# EAGLE design traffic_lights (EAGLE 7.2.0)
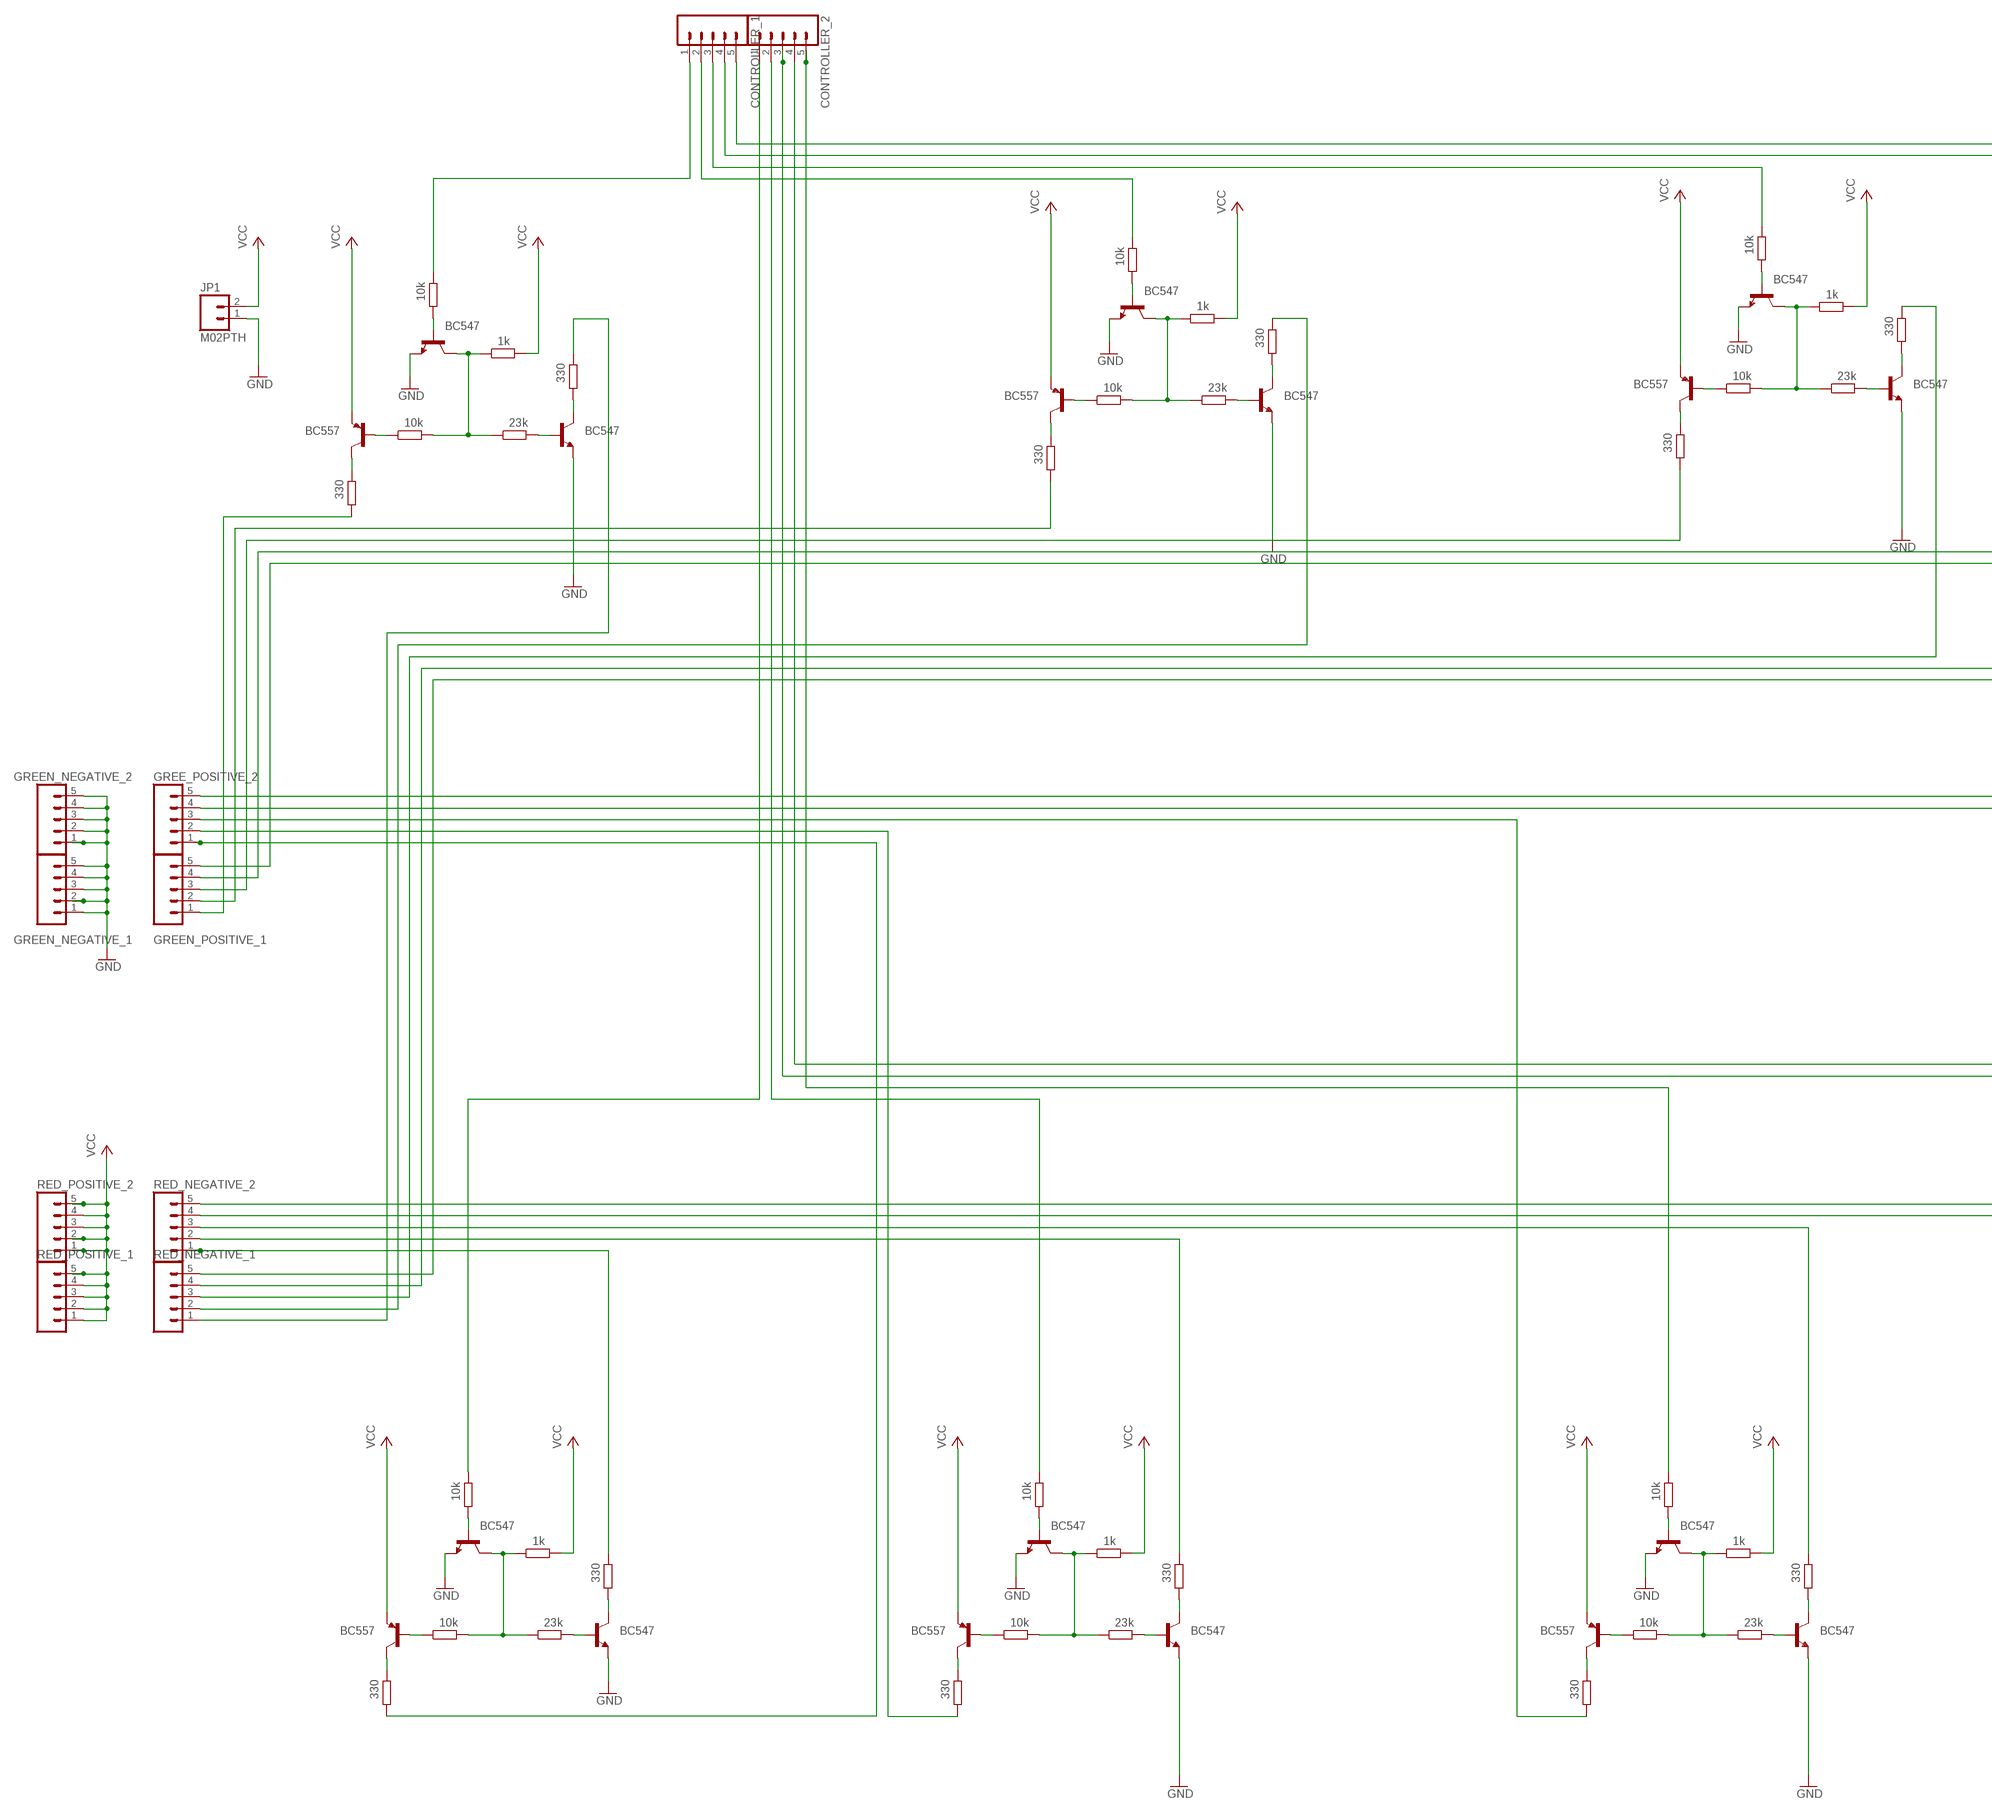
[diagram p0: schematic, sheet 1, part 1 of 2]
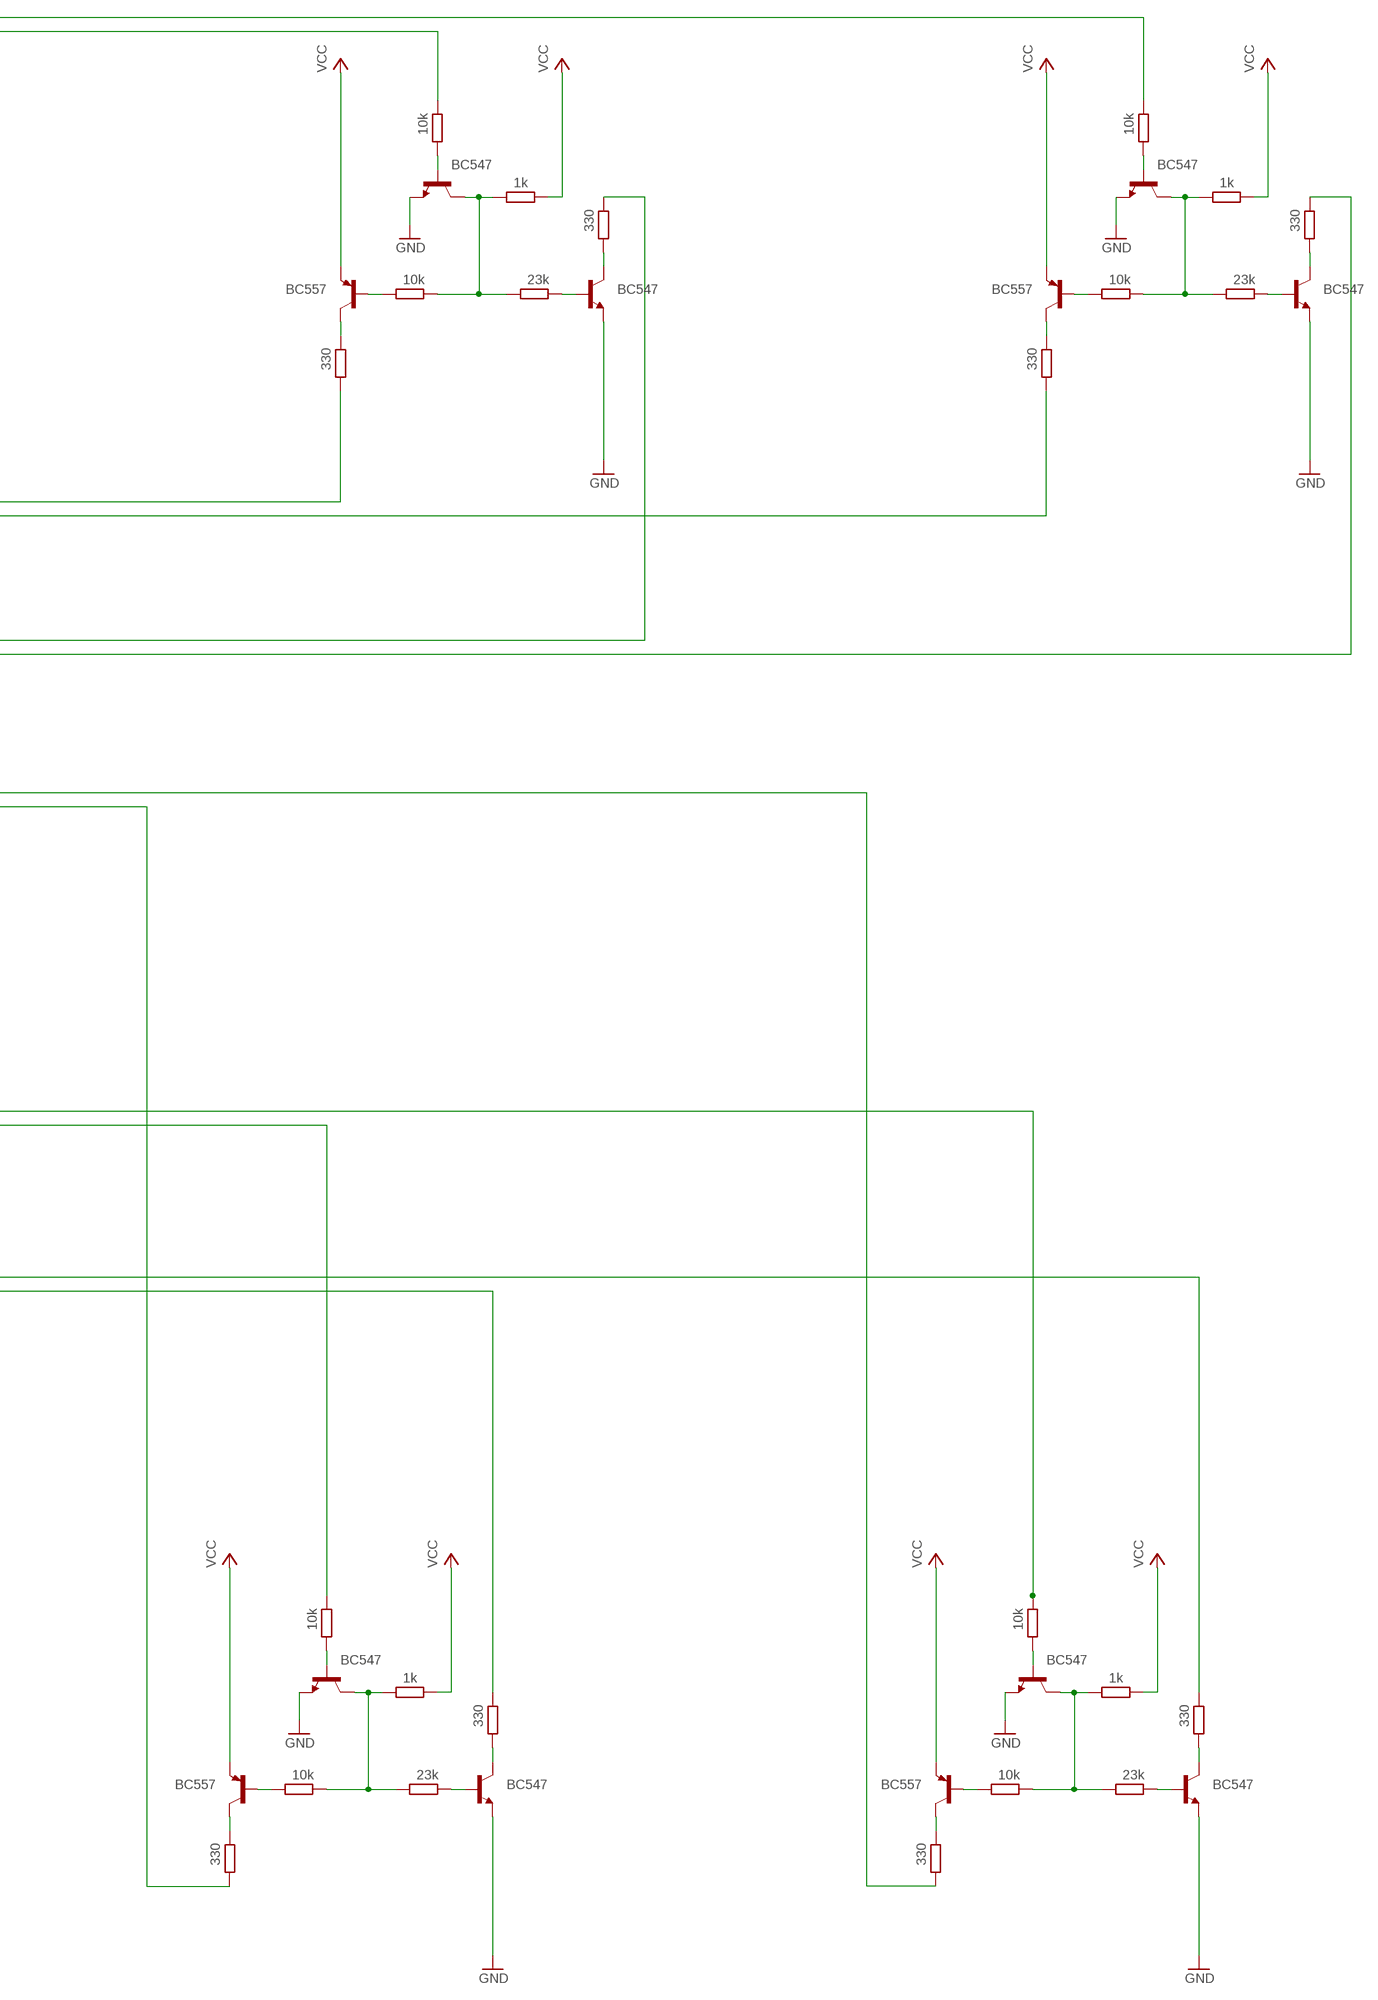
[diagram p1: schematic, sheet 1, part 2 of 2]

## Parts
CONTROLLER_1  M05PTH  [1X05]
CONTROLLER_2  M05PTH  [1X05]
GREE_POSITIVE_2  M05PTH  [1X05]
GREEN_NEGATIVE_1  M05PTH  [1X05]
GREEN_NEGATIVE_2  M05PTH  [1X05]
GREEN_POSITIVE_1  M05PTH  [1X05]
JP1  M02PTH  [1X02]
RC1  10k  R-EU_0207/10  [0207/10]
RC2  1k  R-EU_0207/10  [0207/10]
RC3  23k  R-EU_0207/10  [0207/10]
RC4  10k  R-EU_0207/10  [0207/10]
RC5  330  R-EU_0207/10  [0207/10]
RC6  330  R-EU_0207/10  [0207/10]
RC21  10k  R-EU_0207/10  [0207/10]
RC22  1k  R-EU_0207/10  [0207/10]
RC23  23k  R-EU_0207/10  [0207/10]
RC24  10k  R-EU_0207/10  [0207/10]
RC25  330  R-EU_0207/10  [0207/10]
RC26  330  R-EU_0207/10  [0207/10]
RC31  10k  R-EU_0207/10  [0207/10]
RC32  1k  R-EU_0207/10  [0207/10]
RC33  23k  R-EU_0207/10  [0207/10]
RC34  10k  R-EU_0207/10  [0207/10]
RC35  330  R-EU_0207/10  [0207/10]
RC36  330  R-EU_0207/10  [0207/10]
RC41  10k  R-EU_0207/10  [0207/10]
RC42  1k  R-EU_0207/10  [0207/10]
RC43  23k  R-EU_0207/10  [0207/10]
RC44  10k  R-EU_0207/10  [0207/10]
RC45  330  R-EU_0207/10  [0207/10]
RC46  330  R-EU_0207/10  [0207/10]
RC51  10k  R-EU_0207/10  [0207/10]
RC52  1k  R-EU_0207/10  [0207/10]
RC53  23k  R-EU_0207/10  [0207/10]
RC54  10k  R-EU_0207/10  [0207/10]
RC55  330  R-EU_0207/10  [0207/10]
RC56  330  R-EU_0207/10  [0207/10]
RC61  10k  R-EU_0207/10  [0207/10]
RC62  1k  R-EU_0207/10  [0207/10]
RC63  23k  R-EU_0207/10  [0207/10]
RC64  10k  R-EU_0207/10  [0207/10]
RC65  330  R-EU_0207/10  [0207/10]
RC66  330  R-EU_0207/10  [0207/10]
RC71  10k  R-EU_0207/10  [0207/10]
RC72  1k  R-EU_0207/10  [0207/10]
RC73  23k  R-EU_0207/10  [0207/10]
RC74  10k  R-EU_0207/10  [0207/10]
RC75  330  R-EU_0207/10  [0207/10]
RC76  330  R-EU_0207/10  [0207/10]
RC81  10k  R-EU_0207/10  [0207/10]
RC82  1k  R-EU_0207/10  [0207/10]
RC83  23k  R-EU_0207/10  [0207/10]
RC84  10k  R-EU_0207/10  [0207/10]
RC85  330  R-EU_0207/10  [0207/10]
RC86  330  R-EU_0207/10  [0207/10]
RC91  10k  R-EU_0207/10  [0207/10]
RC92  1k  R-EU_0207/10  [0207/10]
RC93  23k  R-EU_0207/10  [0207/10]
RC94  10k  R-EU_0207/10  [0207/10]
RC95  330  R-EU_0207/10  [0207/10]
RC96  330  R-EU_0207/10  [0207/10]
RC101  10k  R-EU_0207/10  [0207/10]
RC102  1k  R-EU_0207/10  [0207/10]
RC103  23k  R-EU_0207/10  [0207/10]
RC104  10k  R-EU_0207/10  [0207/10]
RC105  330  R-EU_0207/10  [0207/10]
RC106  330  R-EU_0207/10  [0207/10]
RED_NEGATIVE_1  M05PTH  [1X05]
RED_NEGATIVE_2  M05PTH  [1X05]
RED_POSITIVE_1  M05PTH  [1X05]
RED_POSITIVE_2  M05PTH  [1X05]
TCTRL1  BC547  [TO92]
TCTRL2  BC547  [TO92]
TCTRL3  BC547  [TO92]
TCTRL4  BC547  [TO92]
TCTRL5  BC547  [TO92]
TCTRL6  BC547  [TO92]
TCTRL7  BC547  [TO92]
TCTRL8  BC547  [TO92]
TCTRL9  BC547  [TO92]
TCTRL10  BC547  [TO92]
TGR1  BC547  [TO92]
TGR2  BC547  [TO92]
TGR3  BC547  [TO92]
TGR4  BC547  [TO92]
TGR5  BC547  [TO92]
TGR6  BC547  [TO92]
TGR7  BC547  [TO92]
TGR8  BC547  [TO92]
TGR9  BC547  [TO92]
TGR10  BC547  [TO92]
TR1  BC557  [TO92]
TR2  BC557  [TO92]
TR3  BC557  [TO92]
TR4  BC557  [TO92]
TR5  BC557  [TO92]
TR6  BC557  [TO92]
TR7  BC557  [TO92]
TR8  BC557  [TO92]
TR9  BC557  [TO92]
TR10  BC557  [TO92]

## Nets
GND: GREEN_NEGATIVE_1.1 GREEN_NEGATIVE_1.2 GREEN_NEGATIVE_1.3 GREEN_NEGATIVE_1.4 GREEN_NEGATIVE_1.5 GREEN_NEGATIVE_2.1 GREEN_NEGATIVE_2.2 GREEN_NEGATIVE_2.3 GREEN_NEGATIVE_2.4 GREEN_NEGATIVE_2.5 JP1.1 TCTRL1.1(E) TCTRL2.1(E) TCTRL3.1(E) TCTRL4.1(E) TCTRL5.1(E) TCTRL6.1(E) TCTRL7.1(E) TCTRL8.1(E) TCTRL9.1(E) TCTRL10.1(E) TGR1.1(E) TGR2.1(E) TGR3.1(E) TGR4.1(E) TGR5.1(E) TGR6.1(E) TGR7.1(E) TGR8.1(E) TGR9.1(E) TGR10.1(E)
N$1: GREEN_POSITIVE_1.1 RC6.1
N$2: RC21.1 TCTRL2.2(B)
N$3: RC24.1 TR2.2(B)
N$4: RC2.1 RC3.1 RC4.2 TCTRL1.3(C)
N$5: RC1.1 TCTRL1.2(B)
N$6: RC4.1 TR1.2(B)
N$7: RC6.2 TR1.3(C)
N$8: RC26.2 TR2.3(C)
N$9: RC35.2 RED_NEGATIVE_1.3
N$10: RC5.1 TGR1.3(C)
N$11: RC3.2 TGR1.2(B)
N$12: CONTROLLER_1.1 RC1.2
N$13: RC25.2 RED_NEGATIVE_1.2
N$14: RC25.1 TGR2.3(C)
N$15: RC23.2 TGR2.2(B)
N$16: CONTROLLER_1.2 RC21.2
N$17: RC22.1 RC23.1 RC24.2 TCTRL2.3(C)
N$18: CONTROLLER_1.3 RC31.2
N$19: RC31.1 TCTRL3.2(B)
N$20: RC34.1 TR3.2(B)
N$21: RC36.2 TR3.3(C)
N$22: RC45.2 RED_NEGATIVE_1.4
N$23: RC35.1 TGR3.3(C)
N$24: RC33.2 TGR3.2(B)
N$25: CONTROLLER_1.4 RC41.2
N$26: RC32.1 RC33.1 RC34.2 TCTRL3.3(C)
N$27: GREEN_POSITIVE_1.2 RC26.1
N$28: RC41.1 TCTRL4.2(B)
N$29: RC44.1 TR4.2(B)
N$30: RC46.2 TR4.3(C)
N$31: RC55.2 RED_NEGATIVE_1.5
N$32: RC45.1 TGR4.3(C)
N$33: RC43.2 TGR4.2(B)
N$34: CONTROLLER_1.5 RC51.2
N$35: RC42.1 RC43.1 RC44.2 TCTRL4.3(C)
N$36: GREEN_POSITIVE_1.4 RC46.1
N$37: RC51.1 TCTRL5.2(B)
N$38: RC54.1 TR5.2(B)
N$39: RC56.2 TR5.3(C)
N$40: GREEN_POSITIVE_1.3 RC36.1
N$41: RC55.1 TGR5.3(C)
N$42: RC53.2 TGR5.2(B)
N$43: RC5.2 RED_NEGATIVE_1.1
N$44: RC52.1 RC53.1 RC54.2 TCTRL5.3(C)
N$45: GREEN_POSITIVE_1.5 RC56.1
N$46: RC71.1 TCTRL7.2(B)
N$47: RC74.1 TR7.2(B)
N$48: RC76.2 TR7.3(C)
N$49: RC75.2 RED_NEGATIVE_2.2
N$50: RC75.1 TGR7.3(C)
N$51: RC73.2 TGR7.2(B)
N$52: CONTROLLER_2.1 RC61.2
N$53: RC72.1 RC73.1 RC74.2 TCTRL7.3(C)
N$54: RC85.2 RED_NEGATIVE_2.3
N$55: RC81.1 TCTRL8.2(B)
N$56: RC84.1 TR8.2(B)
N$57: RC86.2 TR8.3(C)
N$58: RC95.2 RED_NEGATIVE_2.4
N$59: RC85.1 TGR8.3(C)
N$60: RC83.2 TGR8.2(B)
N$61: CONTROLLER_2.2 RC71.2
N$62: RC82.1 RC83.1 RC84.2 TCTRL8.3(C)
N$63: RC105.2 RED_NEGATIVE_2.5
N$64: RC91.1 TCTRL9.2(B)
N$65: RC94.1 TR9.2(B)
N$66: RC96.2 TR9.3(C)
N$67: GREE_POSITIVE_2.1 RC66.1
N$68: RC95.1 TGR9.3(C)
N$69: RC93.2 TGR9.2(B)
N$70: CONTROLLER_2.5 RC81.2
N$71: RC92.1 RC93.1 RC94.2 TCTRL9.3(C)
N$72: GREE_POSITIVE_2.2 RC76.1
N$73: RC101.1 TCTRL10.2(B)
N$74: RC104.1 TR10.2(B)
N$75: RC106.2 TR10.3(C)
N$76: GREE_POSITIVE_2.3 RC86.1
N$77: RC105.1 TGR10.3(C)
N$78: RC103.2 TGR10.2(B)
N$79: CONTROLLER_2.3 RC91.2
N$80: RC102.1 RC103.1 RC104.2 TCTRL10.3(C)
N$81: GREE_POSITIVE_2.4 RC96.1
N$82: RC61.1 TCTRL6.2(B)
N$83: RC64.1 TR6.2(B)
N$84: RC66.2 TR6.3(C)
N$85: RC65.2 RED_NEGATIVE_2.1
N$86: RC65.1 TGR6.3(C)
N$87: RC63.2 TGR6.2(B)
N$88: GREE_POSITIVE_2.5 RC106.1
N$89: RC62.1 RC63.1 RC64.2 TCTRL6.3(C)
N$90: CONTROLLER_2.4 RC101.2
VCC: JP1.2 RC2.2 RC22.2 RC32.2 RC42.2 RC52.2 RC62.2 RC72.2 RC82.2 RC92.2 RC102.2 RED_POSITIVE_1.1 RED_POSITIVE_1.2 RED_POSITIVE_1.3 RED_POSITIVE_1.4 RED_POSITIVE_1.5 RED_POSITIVE_2.1 RED_POSITIVE_2.2 RED_POSITIVE_2.3 RED_POSITIVE_2.4 RED_POSITIVE_2.5 TR1.1(E) TR2.1(E) TR3.1(E) TR4.1(E) TR5.1(E) TR6.1(E) TR7.1(E) TR8.1(E) TR9.1(E) TR10.1(E)

## Library data of the parts
CONTROLLER_1 CONTROLLER_2 GREE_POSITIVE_2 GREEN_NEGATIVE_1 GREEN_NEGATIVE_2 GREEN_POSITIVE_1 RED_NEGATIVE_1 RED_NEGATIVE_2 RED_POSITIVE_1 RED_POSITIVE_2 = SparkFun-Connectors:M05: Header 5 Standard 5-pin 0.1" header. Use with straight break away headers (SKU : PRT-00116), right angle break away headers (PRT-00553), swiss pins (PRT-00743), machine pins (PRT-00117), and female headers (PRT-00115). Molex polarized connector foot print use with SKU : PRT-08230 with associated crimp pins and housings.
JP1 = SparkFun-Connectors:M02: Standard 2-pin 0.1" header. Use with - straight break away headers ( PRT-00116) - right angle break away headers (PRT-00553) - swiss pins (PRT-00743) - machine pins (PRT-00117) - female headers (PRT-00115) Molex polarized connector foot print use with: PRT-08233 with associated crimp pins and housings. 2.54_SCREWTERM for use with PRT-10571. 3.5mm Screw Terminal footprints for PRT-08084 5mm Screw Terminal footprints for use with PRT-08432
RC1-RC6 RC21-RC26 RC31-RC36 RC41-RC46 RC51-RC56 RC61-RC66 RC71-RC76 RC81-RC86 RC91-RC96 RC101-RC106 = resistor:R-EU_: RESISTOR, European symbol
TCTRL1-TCTRL10 TGR1-TGR10 = transistor:BC547: NPN TRANSISTOR
TR1-TR10 = transistor-pnp:BC557: PNP Transistor

## Net classes
0 default: width 0.762 mm

## Board
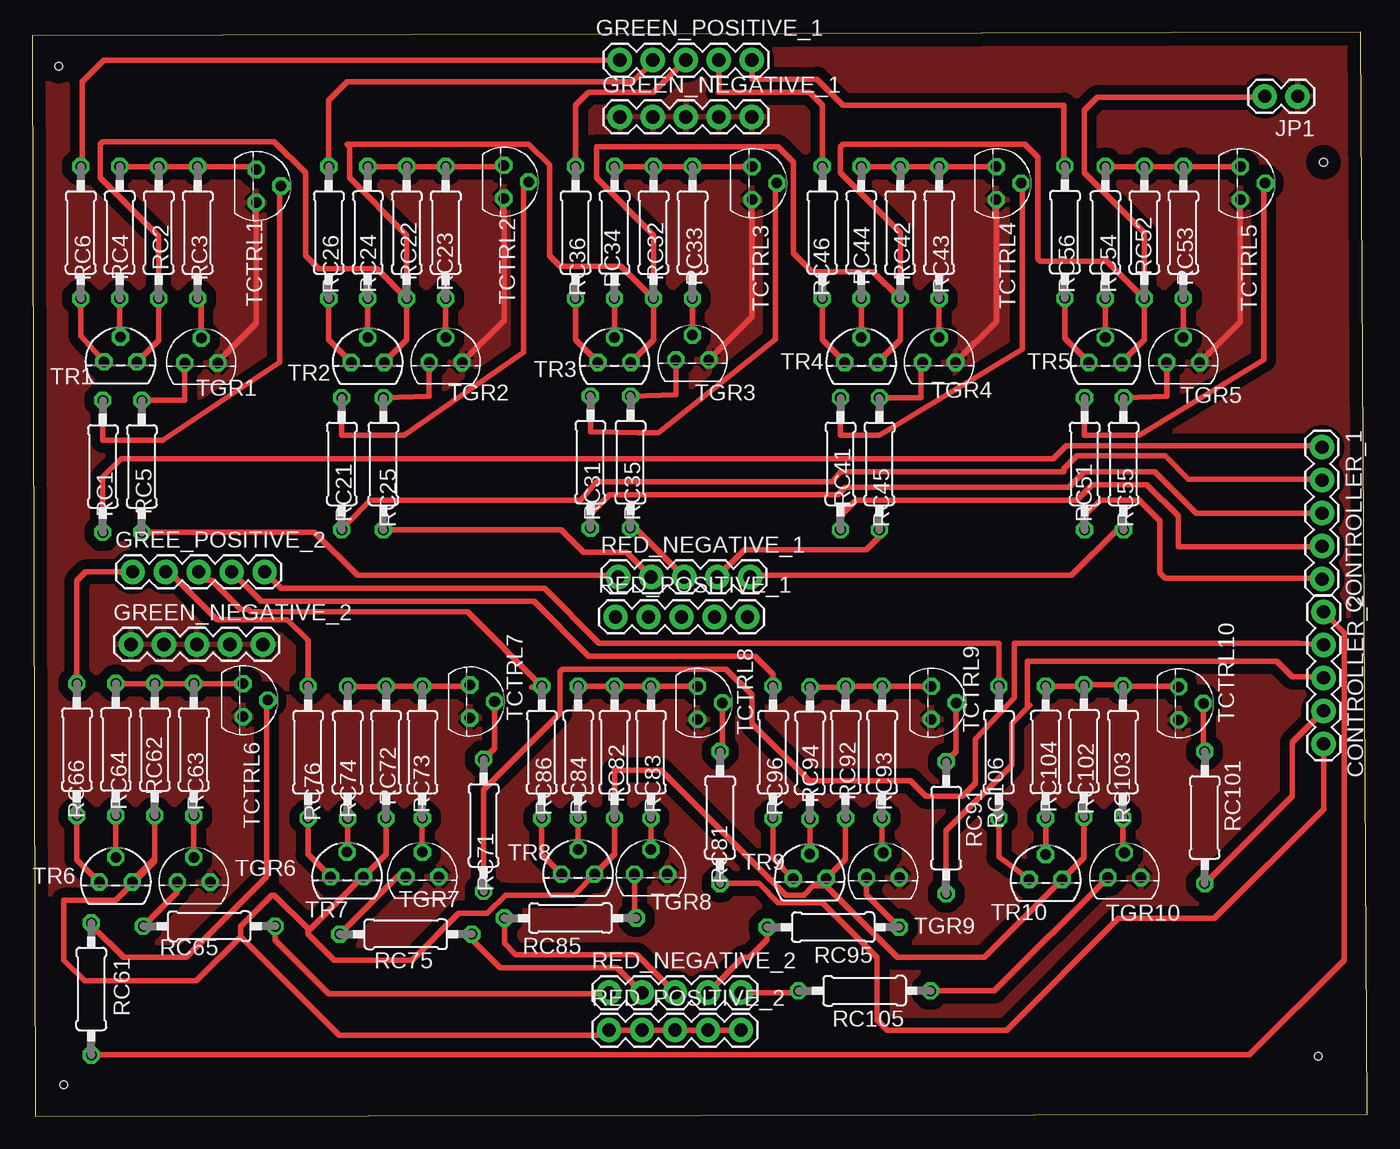
[diagram p2: board, top side]
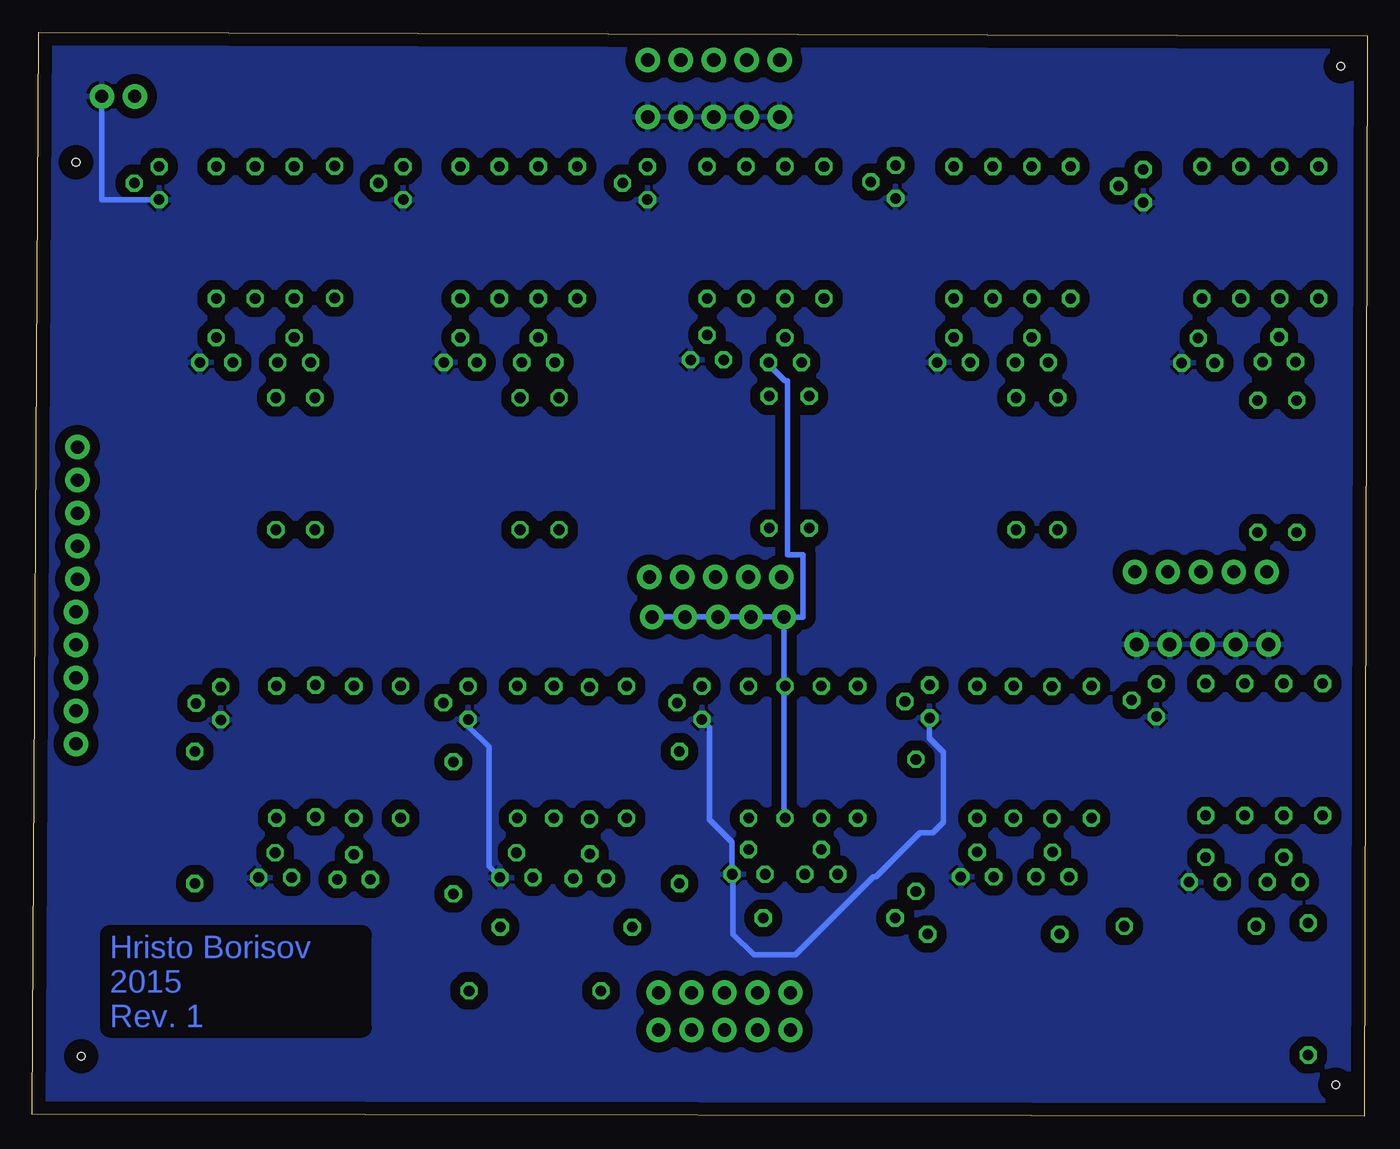
[diagram p3: board, bottom side, seen from below]

Size 102.77 x 83.41 mm. Coordinates in mm from the lower left corner, seen from the top.
Outline: 0.23,0 102.77,0.12 102.27,83.41 0,83.14 0.23,0
Copper layers (1*16): Top 0.035mm / dielectric 1.5mm / Bottom 0.035mm
Design rules "default *": minimum track width 10mil, minimum drill 24mil, track to track 30mil, track to pad 30mil, pad to pad 30mil, via to via 30mil, smd to smd 8mil, copper to edge 40mil, drill to drill 8mil, minimum pad ring 10mil, minimum via ring 8mil, stop-mask expansion 4mil, vias tented up to drill 0mil, thermal gap 10mil
Holes 0.6 mm at 99.42,73.41 2.02,80.81 2.42,2.41 99.02,4.61

### Footprints (pad centres in the part's own frame; a part is rotated, then mirrored left to right if it is on the bottom)
1X05 = drill 1.016 pad 1.88: 1 0,0; 2 2.54,0; 3 5.08,0; 4 7.62,0; 5 10.16,0
1X02 = drill 1.016 pad 1.88: 1 0,0; 2 2.54,0
0207/10 = drill 0.813 octagon: 1 -5.08,0; 2 5.08,0
TO92 = drill 0.813 octagon: 1 1.27,0; 2 0,1.905; 3 -1.27,0

### Placement (x,y rotation side)
CONTROLLER_1  99.3,51.49 270 top
CONTROLLER_2  99.42,38.81 270 top
GREE_POSITIVE_2  7.72,41.89 0 top
GREEN_NEGATIVE_1  45.23,76.91 0 top
GREEN_NEGATIVE_2  7.58,36.3 0 top
GREEN_POSITIVE_1  45.23,81.29 0 top
JP1  97.43,78.49 180 top
RC1  5.42,50.01 270 top
RC2  9.72,68.01 270 top
RC3  12.72,68.01 270 top
RC4  6.72,68.01 90 top
RC5  8.42,50.01 270 top
RC6  3.72,68.01 270 top
RC21  23.82,50.21 270 top
RC22  28.82,68.01 270 top
RC23  31.82,68.01 270 top
RC24  25.82,68.01 90 top
RC25  27.02,50.21 270 top
RC26  22.82,68.01 270 top
RC31  42.96,50.33 270 top
RC32  47.82,68.01 270 top
RC33  50.82,68.01 270 top
RC34  44.82,68.01 90 top
RC35  46.05,50.33 270 top
RC36  41.82,68.01 270 top
RC41  62.22,50.21 270 top
RC42  66.82,68.01 270 top
RC43  69.82,68.01 270 top
RC44  63.82,68.01 90 top
RC45  65.22,50.21 270 top
RC46  60.82,68.01 270 top
RC51  81.02,50.21 270 top
RC52  85.62,68.01 270 top
RC53  88.62,68.01 270 top
RC54  82.62,68.01 90 top
RC55  84.02,50.21 270 top
RC56  79.5,68.04 270 top
RC61  4.53,9.78 270 top
RC62  9.42,28.21 270 top
RC63  12.42,28.21 270 top
RC64  6.42,28.21 90 top
RC65  13.62,14.61 0 top
RC66  3.42,28.21 270 top
RC71  34.74,22.38 270 top
RC72  27.22,28.01 270 top
RC73  30.02,28.01 270 top
RC74  24.27,27.98 90 top
RC75  28.75,14 0 top
RC76  21.22,28.01 270 top
RC81  52.95,22.98 270 top
RC82  44.82,28.01 270 top
RC83  47.62,28.01 270 top
RC84  42.02,28.01 90 top
RC85  41.42,15.24 180 top
RC86  39.22,28.01 270 top
RC91  70.36,22.18 270 top
RC92  62.62,28.01 270 top
RC93  65.42,28.01 270 top
RC94  59.87,27.94 90 top
RC95  61.66,14.54 180 top
RC96  57.02,28.01 270 top
RC101  90.27,22.98 270 top
RC102  80.97,28.1 270 top
RC103  83.97,28.02 270 top
RC104  78.02,28.01 90 top
RC105  64.07,9.64 180 top
RC106  74.42,28.01 270 top
RED_NEGATIVE_1  45.1,41.5 0 top
RED_NEGATIVE_2  44.4,9.5 0 top
RED_POSITIVE_1  44.9,38.42 0 top
RED_POSITIVE_2  44.4,6.62 0 top
TCTRL1  17.23,71.59 270 top
TCTRL2  36.3,71.91 270 top
TCTRL3  55.42,71.81 270 top
TCTRL4  74.22,71.81 270 top
TCTRL5  93.02,71.81 270 top
TCTRL6  16.22,32.01 270 top
TCTRL7  33.68,31.91 270 top
TCTRL8  51.22,31.81 270 top
TCTRL9  69.22,31.81 270 top
TCTRL10  88.27,31.77 270 top
TGR1  13,57.97 0 top
TGR2  31.82,58.01 0 top
TGR3  50.82,58.21 0 top
TGR4  69.82,58.01 0 top
TGR5  88.62,58.01 0 top
TGR6  12.42,18.01 0 top
TGR7  30.02,18.41 0 top
TGR8  47.62,18.61 0 top
TGR9  65.5,18.36 0 top
TGR10  84.08,18.36 0 top
TR1  6.78,58.06 0 top
TR2  25.82,58.01 0 top
TR3  44.82,58.01 0 top
TR4  63.82,58.01 0 top
TR5  82.62,58.01 0 top
TR6  6.42,18.01 0 top
TR7  24.22,18.41 0 top
TR8  42.02,18.61 0 top
TR9  59.85,18.28 0 top
TR10  78.02,18.21 0 top

### Tracks (layer width: path | path; a pad name or v marks a point on that pad's centre or on a via)
GND
  Top 0.406: TGR1.1 14.27,58.06 17.22,61.01 TCTRL1.1 | TCTRL2.1 36.3,61.22 TGR2.1 | TCTRL3.1 55.42,61.54 TGR3.1 | TCTRL4.1 74.22,61.14 TGR4.1 | TCTRL5.1 93.02,61.14 TGR5.1
  Bottom 0.406: 55.39,70.57 TCTRL3.1 | TCTRL7.1 33.68,29.07 32.62,28.01 32.62,22.61 33.42,21.81 34.42,21.81 37.82,18.41 38.02,18.41 44.02,12.41 47.22,12.41 48.82,14.01 48.82,18.54 TGR8.1 48.89,21.08 50.62,22.81 50.62,29.94 TCTRL8.1 | TCTRL9.1 69.22,30.01 67.62,28.41 67.62,19.21 TGR9.1 | 14.27,58.01 TGR1.1 | TCTRL5.1 97.43,70.54 JP1.1
  pour Top: -2.58,88.46 105.14,88.46 104.64,-3.69 -2.58,-4.19
  pour Bottom: -3.38,85.61 106.02,85.61 106.02,-5.59 -3.58,-5.59 -3.58,86.21 -3.38,86.21
N$1
  Top 0.406: GREEN_POSITIVE_1.1 5.5,81.29 3.82,79.61 3.82,73.19 RC6.1
N$2
  Top 0.406: RC21.1 23.82,52.41 28.62,52.41 37.82,58.81 37.82,71.53 TCTRL2.2
N$3
  Top 0.406: RC24.1 TR2.2
N$4
  Top 0.406: RC4.2 RC2.1 RC3.1 17,73.09 TCTRL1.3
N$5
  Top 0.406: RC1.1 5.42,52.01 10.02,52.01 19.02,58.01 19.02,71.48 TCTRL1.2
N$6
  Top 0.406: RC4.1 6.72,60.02 TR1.2
N$7
  Top 0.406: RC6.2 3.72,60.05 TR1.3
N$8
  Top 0.406: RC26.2 22.82,59.74 TR2.3
N$9
  Top 0.406: RC35.2 46.43,45.25 RED_NEGATIVE_1.3
N$10
  Top 0.406: TGR1.3 11.73,55.09 RC5.1
N$11
  Top 0.406: TGR1.2 13,62.65 RC3.2
N$12
  Top 0.406: RC1.2 5.42,49.21 6.82,50.61 78.62,50.61 79.62,51.61 99.18,51.61 CONTROLLER_1.1
N$13
  Top 0.406: RC25.2 40.7,45.13 42.42,43.41 45.73,43.41 RED_NEGATIVE_1.2
N$14
  Top 0.406: TGR2.3 30.55,55.42 RC25.1
N$15
  Top 0.406: RC23.2 TGR2.2
N$16
  Top 0.406: RC21.2 24.22,45.61 26.02,47.41 42.22,47.41 43.42,48.81 61.62,48.81 62.22,49.61 79.42,49.61 79.42,49.81 80.42,50.81 87.22,50.81 89.02,49.01 99.24,49.01 CONTROLLER_1.2
N$17
  Top 0.406: RC24.2 RC22.1 RC23.1 36.21,73.09 TCTRL2.3
N$18
  Top 0.406: RC31.2 42.96,46.35 44.42,47.81 62.02,47.81 62.62,48.41 79.82,48.41 81.02,49.61 86.42,49.61 89.62,46.41 CONTROLLER_1.3
N$19
  Top 0.406: RC31.1 42.96,52.67 46.62,52.61 48.22,52.61 57.22,59.81 57.22,71.7 TCTRL3.2
N$20
  Top 0.406: RC34.1 TR3.2
N$21
  Top 0.406: RC36.2 41.82,59.74 TR3.3
N$22
  Top 0.406: RC45.2 65.22,44.61 64.22,43.61 54.83,43.61 RED_NEGATIVE_1.4
N$23
  Top 0.406: TGR3.3 49.55,55.51 RC35.1
N$24
  Top 0.406: TGR3.2 RC33.2
N$25
  Top 0.406: RC41.2 62.22,46.21 63.42,47.41 80.42,47.41 81.62,48.61 85.82,48.61 88.22,46.21 88.22,43.81 99.24,43.81 CONTROLLER_1.4
N$26
  Top 0.406: RC34.2 RC32.1 RC33.1 TCTRL3.3
N$27
  Top 0.406: GREEN_POSITIVE_1.2 47.77,81.16 46.22,79.61 24.22,79.61 22.82,78.21 RC26.1
N$28
  Top 0.406: RC41.1 62.22,52.41 65.22,52.41 76.22,59.01 76.22,71.72 TCTRL4.2
N$29
  Top 0.406: RC44.1 TR4.2
N$30
  Top 0.406: RC46.2 60.82,59.74 TR4.3
N$31
  Top 0.406: RC55.2 83.54,45.13 80.02,41.61 55.37,41.61 RED_NEGATIVE_1.5
N$32
  Top 0.406: TGR4.3 68.55,57.94 68.42,57.81 68.42,55.29 RC45.1
N$33
  Top 0.406: RC43.2 TGR4.2
N$34
  Top 0.406: RC51.2 81.02,46.21 82.22,47.41 85.22,47.41 86.82,45.81 86.82,41.81 87.22,41.41 99.22,41.41 CONTROLLER_1.5
N$35
  Top 0.406: RC44.2 RC42.1 RC43.1 TCTRL4.3
N$36
  Top 0.406: GREEN_POSITIVE_1.4 52.85,78.84 52.82,78.81 59.82,78.81 60.82,77.81 RC46.1
N$37
  Top 0.406: RC51.1 81.02,52.41 85.22,52.41 94.82,58.21 94.82,71.7 TCTRL5.2
N$38
  Top 0.406: RC54.1 TR5.2
N$39
  Top 0.406: RC56.2 79.5,59.86 TR5.3
N$40
  Top 0.406: GREEN_POSITIVE_1.3 47.82,78.81 42.82,78.81 41.82,77.81 RC36.1
N$41
  Top 0.406: TGR5.3 87.35,55.42 RC55.1
N$42
  Top 0.406: RC53.2 TGR5.2
N$43
  Top 0.406: RC5.2 21.7,44.93 25.02,41.61 44.99,41.61 RED_NEGATIVE_1.1
N$44
  Top 0.406: RC54.2 RC52.1 RC53.1 TCTRL5.3
N$45
  Top 0.406: GREEN_POSITIVE_1.5 55.39,79.84 55.42,79.81 60.42,79.81 62.42,77.81 79.42,77.81 79.42,73.2 RC56.1
N$46
  Top 0.406: TCTRL7.2 35.59,28.31 RC71.1
N$47
  Top 0.406: RC74.1 24.27,20.37 TR7.2
N$48
  Top 0.406: RC76.2 21.22,20.14 TR7.3
N$49
  Top 0.406: RC75.2 33.83,13.6 36.02,11.41 45.03,11.41 RED_NEGATIVE_2.2
N$50
  Top 0.406: TGR7.3 28.08,18.41 RC75.1
N$51
  Top 0.406: RC73.2 TGR7.2
N$52
  Top 0.406: RC61.2 93.71,4.7 101.02,12.01 101.02,37.21 CONTROLLER_2.1
N$53
  Top 0.406: RC74.2 27.19,33.06 RC72.1 RC73.1 33.59,33.09 TCTRL7.3
N$54
  Top 0.406: RC85.2 36.34,13.29 37.22,12.41 46.57,12.41 RED_NEGATIVE_2.3
N$55
  Top 0.406: TCTRL8.2 53.12,28.24 RC81.1
N$56
  Top 0.406: RC84.1 TR8.2
N$57
  Top 0.406: RC86.2 39.22,20.14 TR8.3
N$58
  Top 0.406: RC95.2 56.58,13.57 55.22,12.21 54.73,12.21 RED_NEGATIVE_2.4
N$59
  Top 0.406: TGR8.3 46.35,15.39 RC85.1
N$60
  Top 0.406: RC83.2 TGR8.2
N$61
  Top 0.406: RC71.2 34.74,25.13 40.62,31.01 40.62,34.21 40.82,34.41 53.42,34.41 55.42,32.41 55.42,30.21 59.82,25.81 67.62,25.81 68.82,24.61 71.62,24.61 72.62,25.61 72.62,29.01 75.62,32.21 75.62,36.41 97.56,36.41 CONTROLLER_2.2
N$62
  Top 0.406: RC84.2 RC82.1 RC83.1 TCTRL8.3
N$63
  Top 0.406: RED_NEGATIVE_2.5 58.85,9.5 RC105.2
N$64
  Top 0.406: TCTRL9.2 71.12,28.03 RC91.1
N$65
  Top 0.406: RC94.1 59.87,20.21 TR9.2
N$66
  Top 0.406: RC96.2 57.02,19.84 TR9.3
N$67
  Top 0.406: GREE_POSITIVE_2.1 4.1,41.89 3.42,41.21 RC66.1
N$68
  Top 0.406: TGR9.3 64.23,17.05 RC95.1
N$69
  Top 0.406: RC93.2 65.42,20.35 TGR9.2
N$70
  Top 0.406: RC81.2 55.93,17.9 57.42,16.41 60.82,16.41 65.02,12.21 65.02,7.41 65.82,6.61 75.02,6.61 83.62,15.21 91.02,15.21 99.42,23.61 CONTROLLER_2.5
N$71
  Top 0.406: RC94.2 62.55,33.02 RC92.1 RC93.1 TCTRL9.3
N$72
  Top 0.406: GREE_POSITIVE_2.2 10.54,41.89 14.22,38.21 19.62,38.21 21.22,36.61 RC76.1
N$73
  Top 0.406: TCTRL10.2 90.17,28.16 RC101.1
N$74
  Top 0.406: RC104.1 TR10.2
N$75
  Top 0.406: RC106.2 74.42,19.94 TR10.3
N$76
  Top 0.406: GREE_POSITIVE_2.3 12.8,41.23 13.8,41.23 16.02,39.01 16.62,39.01 16.82,38.81 33.5,38.81 RC86.1 39.14,33.01 38.42,33.01
N$77
  Top 0.406: RC105.1 74.09,9.64 TGR10.3
N$78
  Top 0.406: RC103.2 83.97,20.38 TGR10.2
N$79
  Top 0.406: RC91.2 70.36,21.95 75.42,27.01 75.42,30.21 76.82,31.61 76.62,31.61 76.62,35.01 95.82,35.01 97.02,33.81 99.34,33.81 CONTROLLER_2.3
N$80
  Top 0.406: RC104.2 80.88,33.09 RC102.1 83.89,33.18 RC103.1 88.21,33.1 TCTRL10.3
N$81
  Top 0.406: RC96.1 57.02,34.01 55.62,35.41 42.82,35.41 38.62,39.61 17.62,39.61 GREE_POSITIVE_2.4
N$82
  Top 0.406: RC61.1 4.53,14.7 7.02,12.21 11.82,12.21 18.02,18.41 18.02,31.91 TCTRL6.2
N$83
  Top 0.406: RC64.1 TR6.2
N$84
  Top 0.406: RC66.2 3.42,19.74 TR6.3
N$85
  Top 0.406: RC65.2 18.7,13.53 22.82,9.41 44.31,9.41 RED_NEGATIVE_2.1
N$86
  Top 0.406: TGR6.3 11.15,17.22 RC65.1
N$87
  Top 0.406: RC63.2 TGR6.2
N$88
  Top 0.406: RC106.1 74.42,36.41 43.62,36.41 39.42,40.61 19.16,40.61 GREE_POSITIVE_2.5
N$89
  Top 0.406: RC64.2 RC62.1 RC63.1 TCTRL6.3
N$90
  Top 0.406: RC101.2 90.31,17.9 97.02,24.61 97.02,28.79 CONTROLLER_2.4
VCC
  Top 0.406: TR1.1 9.72,59.73 RC2.2 9.72,67.71 5.22,72.21 5.22,74.81 5.42,75.01 18.62,75.01 21.02,72.61 21.02,66.21 22.02,65.21 26.54,65.21 RC22.2 | RC22.2 28.82,59.74 TR2.1 | RC32.2 47.82,59.74 TR3.1 | RC42.2 66.82,59.74 TR4.1 | RC52.2 85.62,59.74 TR5.1 | RC62.2 9.42,19.74 | 9.42,19.74 TR6.1 | RC72.2 27.22,20.14 TR7.1 25.42,18.41 21.22,14.21 | RC92.2 62.62,19.78 TR9.1 61.12,17.71 | RC102.2 80.97,19.89 TR10.1 73.29,12.21 66.62,12.21 61.12,17.71 | 9.42,19.74 9.35,19.74 7.42,17.81 | 21.22,14.21 21.22,14.01 23.22,12.01 29.22,12.01 32.82,15.61 35.02,15.61 36.42,17.01 41.69,17.01 TR8.1 44.82,20.14 RC82.2 44.82,26.61 48.42,26.61 58.02,17.01 59.42,17.01 60.12,17.71 61.12,17.71 | RC52.2 85.62,68.01 81.02,72.61 81.02,77.41 82.02,78.41 94.81,78.41 JP1.2 | RC22.2 28.82,67.81 24.42,72.21 24.42,74.61 24.22,74.81 38.22,74.81 39.82,73.21 39.82,66.21 40.62,65.41 45.34,65.41 RC32.2 | RC32.2 47.82,67.81 43.42,72.21 43.42,74.61 57.42,74.61 58.62,73.41 58.62,66.41 60.02,65.01 64.74,65.01 RC42.2 | RC42.2 66.82,68.01 62.22,72.61 62.22,74.61 62.42,74.81 76.42,74.81 77.42,73.81 77.42,66.01 77.62,65.81 82.74,65.81 RC52.2 | 21.22,14.21 21.22,14.41 18.62,17.01 18.42,17.01 16.02,14.61 16.02,13.81 | 16.02,13.81 23.62,6.21 43.99,6.21 RED_POSITIVE_2.1 RED_POSITIVE_2.2 RED_POSITIVE_2.3 RED_POSITIVE_2.4 RED_POSITIVE_2.5 | 9.42,19.74 9.42,19.61 6.42,16.61 2.42,16.61 2.42,12.01 4.02,10.41 12.62,10.41 16.02,13.81
  Bottom 0.406: TR3.1 46.09,57.88 44.82,56.61 44.62,56.61 44.62,43.21 43.42,43.21 43.42,38.41 RED_POSITIVE_1.1 | 44.82,38.5 RED_POSITIVE_1.1 | RED_POSITIVE_1.1 RED_POSITIVE_1.2 RED_POSITIVE_1.3 RED_POSITIVE_1.4 RED_POSITIVE_1.5 | RED_POSITIVE_1.1 44.9,23.01 RC82.2

### Text on the board
Bottom: Hristo Borisov / 2015 / Rev. 1